# EAGLE design ModulCzujnika (EAGLE 9.6.2)

## Sheet 1 of 2
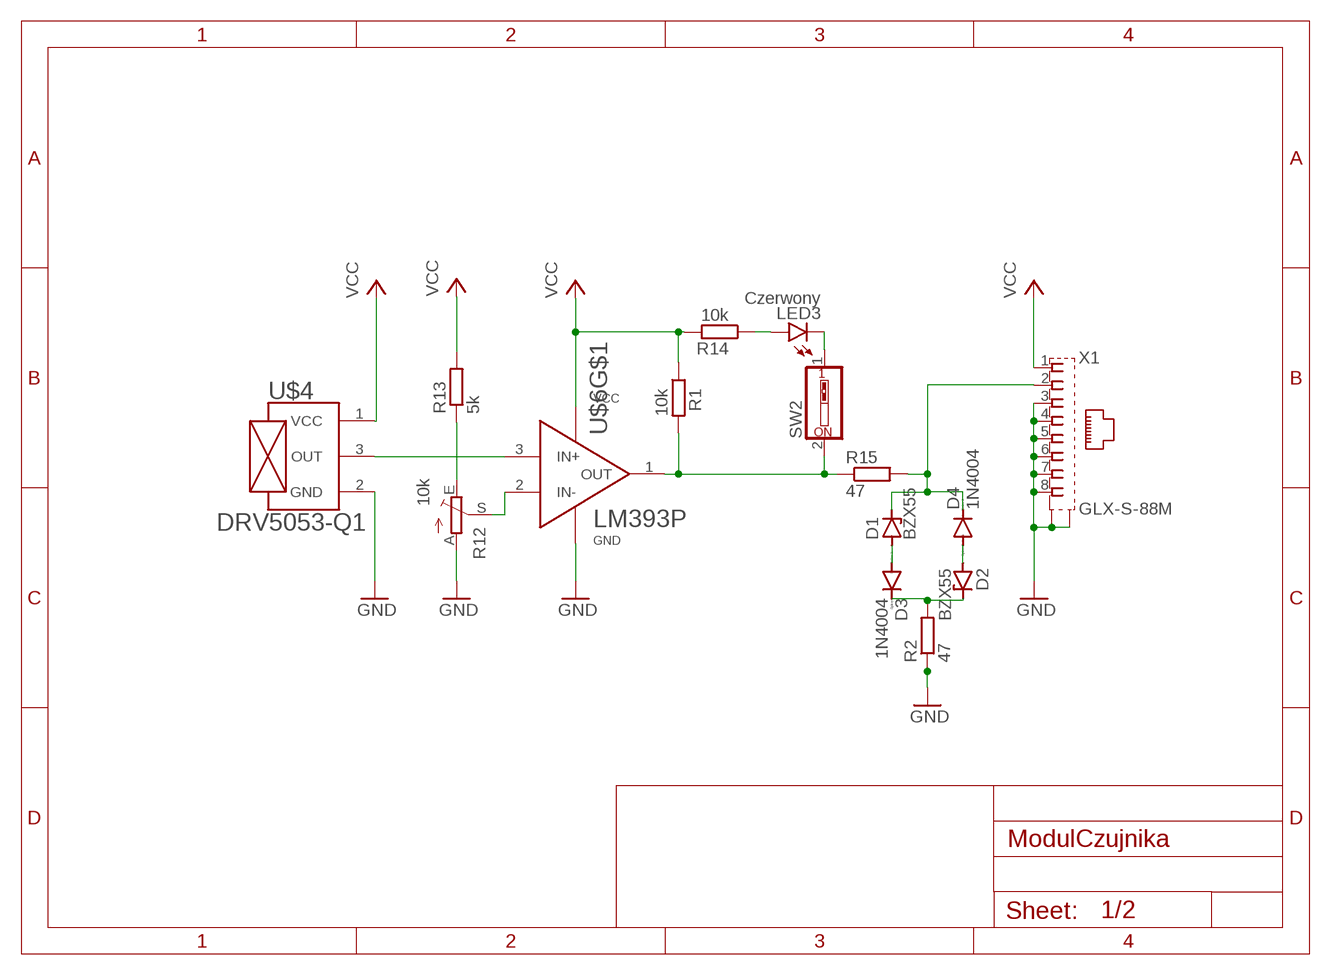
[diagram p0: schematic, sheet 1]

### Parts
D1  BZX55  [DO35Z10]
D2  BZX55  [DO35Z10]
D3  1N4004  [DO41-10]
D4  1N4004  [DO41-10]
LED3  Czerwony  LED5MM  [LED5MM]
R1  10k  R-EU_0207/7  [0207/7]
R2  47  R-EU_0207/7  [0207/7]
R12  10k  TRIM_EU-CA6V  [CA6V]
R13  5k  R-EU_0207/7  [0207/7]
R14  10k  R-EU_0207/7  [0207/7]
R15  47  R-EU_0207/7  [0207/7]
SW2  SW_DIP-1  [EDG-01]
U$4  DRV5053-Q1  [TO-92]
U$6  LM393P  [R-PDIP-T8]
X1  GLX-S-88M  [GLX-S-88M]

### Nets
GND: R2.1 R12.A U$4.2(GND) U$6.4(GND) X1.3 X1.4 X1.5 X1.6 X1.7 X1.8 X1.S1 X1.S2
N$1: D2.C D3.C R2.2
N$2: D1.C D4.C R15.2 X1.2
N$3: D2.A D4.A
N$4: D1.A D3.A
N$11: U$4.3(OUT) U$6.3(IN+)
N$14: R12.S U$6.2(IN-)
N$24: R1.2 R15.1 SW2.2 U$6.1(OUT)
N$25: R12.E R13.1
N$28: LED3.A R14.1
N$29: LED3.K(C) SW2.1
VCC: R1.1 R13.2 R14.2 U$4.1(VCC) U$6.8(VCC) X1.1
Unconnected: U$6.5(IN+) U$6.6(IN-) U$6.7(OUT)

## Sheet 2 of 2

## Library data of the parts
D1 D2 = diode:BZX55: Z DIODE
D3 D4 = diode:1N4004: DIODE general purpose rectifier, 1 A
LED3 = led:LED: LED OSRAM: - CHIPLED LG R971, LG N971, LY N971, LG Q971, LY Q971, LO R971, LY R971 LH N974, LH R974 LS Q976, LO Q976, LY Q976 LO Q996 - Hyper CHIPLED LW Q18S LB Q993, LB Q99A, LB R99A - SideLED LS A670, LO A670, LY A670, LG A670, LP A670 LB A673, LV A673, LT A673, LW A673 LH A674 LY A675 LS A676, LA A676, LO A676, LY A676, LW A676 LS A679, LY A679, LG A679 - Hyper Micro SIDELED® LS Y876, LA Y876, LO Y876, LY Y876 LT Y87S - SmartLED LW L88C, LW L88S LB L89C, LB L89S, LG L890 LS L89K, LO L89K, LY L89K LS L896, LA L896, LO L896, LY L896 - TOPLED LS T670, LO T670, LY T670, LG T670, LP T670 LSG T670, LSP T670, LSY T670, LOP T670, LYG T670 LG T671, LOG T671, LSG T671 LB T673, LV T673, LT T673, LW T673 LH T674 LS T676, LA T676, LO T676, LY T676, LB T676, LH T676, LSB T676, LW T676 LB T67C, LV T67C, LT T67C, LS T67K, LO T67K, LY T67K, LW E67C LS E67B, LA E67B, LO E67B, LY E67B, LB E67C, LV E67C, LT E67C LW T67C LS T679, LY T679, LG T679 LS T770, LO T770, LY T770, LG T770, LP T770 LB T773, LV T773, LT T773, LW T773 LH T774 LS E675, LA E675, LY E675, LS T675 LS T776, LA T776, LO T776, LY T776, LB T776 LHGB T686 LT T68C, LB T68C - Hyper Mini TOPLED® LB M676 - Mini TOPLED Santana® LG M470 LS M47K, LO M47K, LY M47K Source: http://www.osram.convergy.de LUXEON: - LUMILED® LXK2-PW12-R00, LXK2-PW12-S00, LXK2-PW14-U00, LXK2-PW14-V00 LXK2-PM12-R00, LXK2-PM12-S00, LXK2-PM14-U00 LXK2-PE12-Q00, LXK2-PE12-R00, LXK2-PE12-S00, LXK2-PE14-T00, LXK2-PE14-U00 LXK2-PB12-K00, LXK2-PB12-L00, LXK2-PB12-M00, LXK2-PB14-N00, LXK2-PB14-P00, LXK2-PB14-Q00 LXK2-PR12-L00, LXK2-PR12-M00, LXK2-PR14-Q00, LXK2-PR14-R00 LXK2-PD12-Q00, LXK2-PD12-R00, LXK2-PD12-S00 LXK2-PH12-R00, LXK2-PH12-S00 LXK2-PL12-P00, LXK2-PL12-Q00, LXK2-PL12-R00 Source: www.luxeon.com KINGBRIGHT: KA-3528ASYC Source: www.kingbright.com
R1 R2 R13-R15 = rcl:R-EU_: RESISTOR, European symbol; SPICEPREFIX: R
R12 = pot:TRIM_EU-: POTENTIOMETER
SW2 = special:SW_DIP-1: DIP SWITCH
U$4 = BezkonataktowyLicznikObrotów:DRV5053-Q1
U$6 = BezkonataktowyLicznikObrotów:LM393P
X1 = con-kycon:GLX-S-88M: Mod. Jack, Right Angle, 8 posiotion, 8 contatcs RJ45 Source: GLX-S-88M.pdf; OC_FARNELL: unknown; OC_NEWARK: unknown

## Board
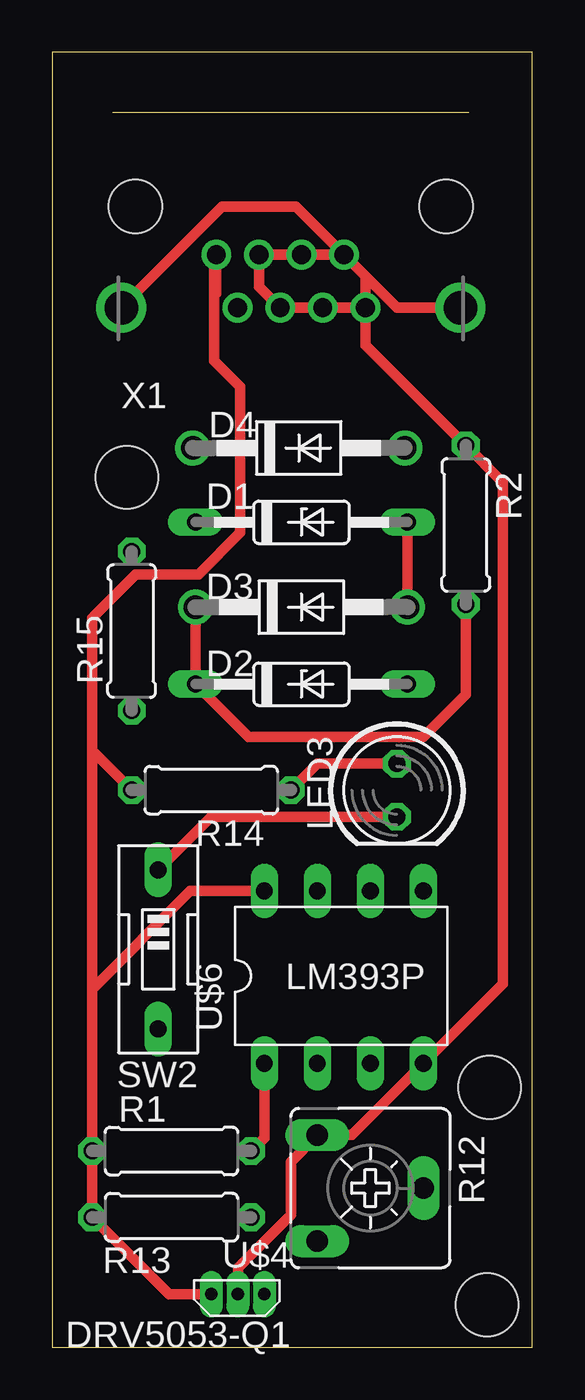
[diagram p1: board, top side]
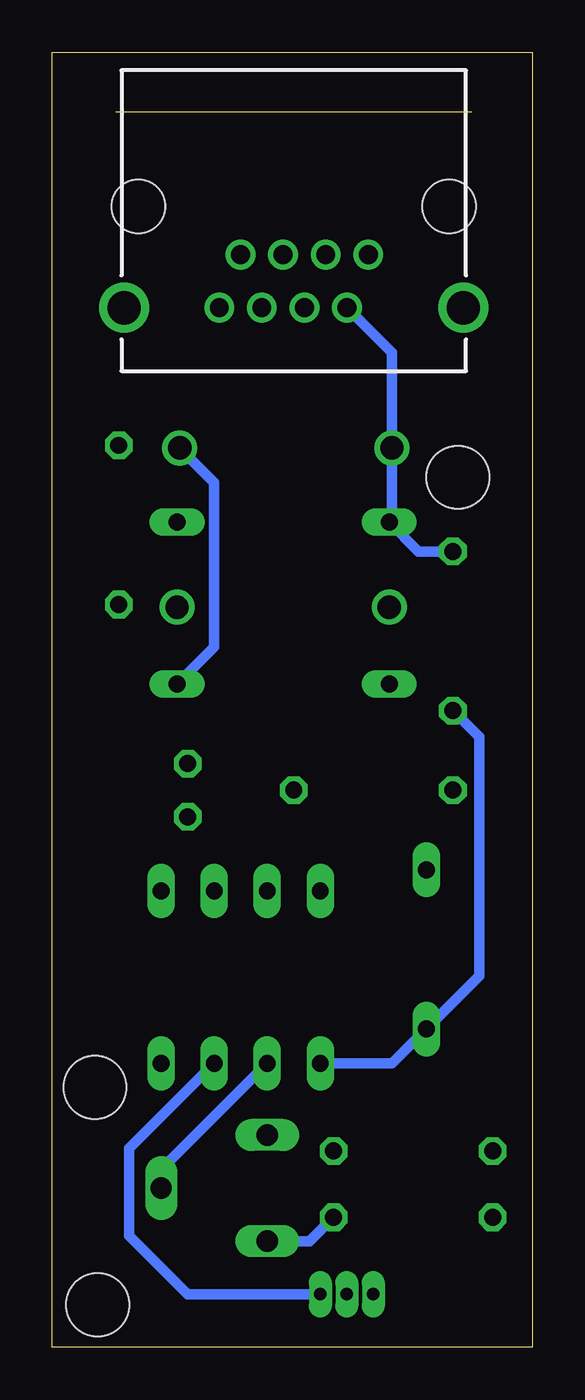
[diagram p2: board, bottom side, seen from below]

Size 23 x 62 mm. Coordinates in mm from the lower left corner, seen from the top.
Outline: 0,0 23,0 23,62 0,62 0,0
Copper layers (1*16): Top 0.035mm / dielectric 1.5mm / Bottom 0.035mm
Design rules "default": minimum track width 6mil, minimum drill 0.35mm, track to track 6mil, track to pad 6mil, pad to pad 6mil, via to via 6mil, smd to smd 6mil, copper to edge 40mil, drill to drill 6mil, minimum pad ring 10mil, minimum via ring 8mil, stop-mask expansion 4mil, vias tented up to drill 0mil, thermal gap 10mil
Holes 3 mm at 20.95,12.45 20.83,2.03 3.58,41.65

### Footprints (pad centres in the part's own frame; a part is rotated, then mirrored left to right if it is on the bottom)
DO35Z10 = drill 0.813 long: A 5.08,0; C -5.08,0
DO41-10 = drill 1.118: A 5.08,0; C -5.08,0
LED5MM = drill 0.813 octagon: A -1.27,0; K 1.27,0
0207/7 = drill 0.813 octagon: 1 -3.81,0; 2 3.81,0
CA6V = drill 1.016 long: A -2.54,-2.54; E 2.54,-2.54; S 0,2.54
EDG-01 = drill 0.813 long: 1 0,-3.81; 2 0,3.81
TO-92 = drill 0.6 long: 1 1.27,0; 2 0,0; 3 -1.27,0
R-PDIP-T8 = drill 0.8 long: 1 -3.81,-4.191; 2 -1.27,-4.191; 3 1.27,-4.191; 4 3.81,-4.191; 5 3.81,4.064; 6 1.27,4.064; 7 -1.27,4.064; 8 -3.81,4.064
GLX-S-88M = drill 0.9 pad 1.422: 1 -3.57,-2.3; 2 -2.55,-4.84; 3 -1.53,-2.3; 4 -0.51,-4.84; 5 0.51,-2.3; 6 1.53,-4.84; 7 2.55,-2.3; 8 3.57,-4.84 | drill 1.6 pad 2.184: S1 -8.125,-4.84; S2 8.125,-4.84 | hole 2.55: -7.44,0; 7.44,0

### Placement (x,y rotation side)
D1  11.94,39.5 0 top
D2  11.94,31.75 0 top
D3  11.94,35.43 0 top
D4  11.81,43.05 0 top
LED3  16.51,26.67 270 top
R1  5.71,9.4 0 top
R2  19.81,39.37 270 top
R12  15.24,7.62 270 top
R13  5.71,6.22 180 top
R14  7.62,26.67 180 top
R15  3.81,34.29 90 top
SW2  5.08,19.05 180 top
U$4  8.89,2.54 180 top
U$6  13.97,17.78 0 top
X1  11.43,54.61 0 top

### Tracks (layer width: path | path; a pad name or v marks a point on that pad's centre or on a via)
GND
  Top 0.508: U$4.2 8.89,3.81 11.43,6.35 11.43,8.89 R12.A 14.35,10.16 U$6.4 21.59,17.4 21.59,41.4 R2.1 19.79,43.18 15,47.97 X1.8 | X1.8 X1.6 X1.4 9.91,50.78 9.9,50.78 9.9,50.79 X1.3 X1.5 X1.7 | X1.8 15,51.29 | 15,51.29 X1.7 | X1.S1 8.14,54.61 11.68,54.61 X1.7 | 15,51.29 16.52,49.77 X1.S2
N$1
  Top 0.508: D3.C D2.C 9.4,29.21 17.78,29.21 19.81,31.24 R2.2
N$2
  Bottom 0.508: R15.2 5.46,38.1 D1.C 6.73,39.62 D4.C 6.73,47.62 X1.2
N$3
  Bottom 0.508: D2.A 15.24,33.53 15.24,41.4 D4.A
N$4
  Top 0.508: D1.A D3.A
N$11
  Bottom 0.508: U$6.3 19.3,9.53 19.3,5.33 16.51,2.54 U$4.3
N$14
  Bottom 0.508: R12.S 17.78,8.51 U$6.2
N$24
  Top 0.508: U$6.1 10.16,10.03 R1.2
  Bottom 0.508: U$6.1 6.73,13.59 SW2.2 2.54,17.78 2.54,29.21 R15.1
N$25
  Bottom 0.508: R12.E 10.67,5.08 R13.1
N$28
  Top 0.508: LED3.A 12.7,27.94 R14.1
N$29
  Top 0.508: SW2.1 7.62,25.4 LED3.K
VCC
  Top 0.508: U$4.1 5.59,2.54 R13.2 R1.1 1.91,17.14 | 1.91,17.14 1.91,28.57 | 7.86,50.43 X1.1 7.76,52.21 7.76,47.24 9,46 9,39 7,37 4,37 1.91,34.91 1.91,28.57 | U$6.8 6.6,21.84 1.91,17.14 | R14.2 1.91,28.57